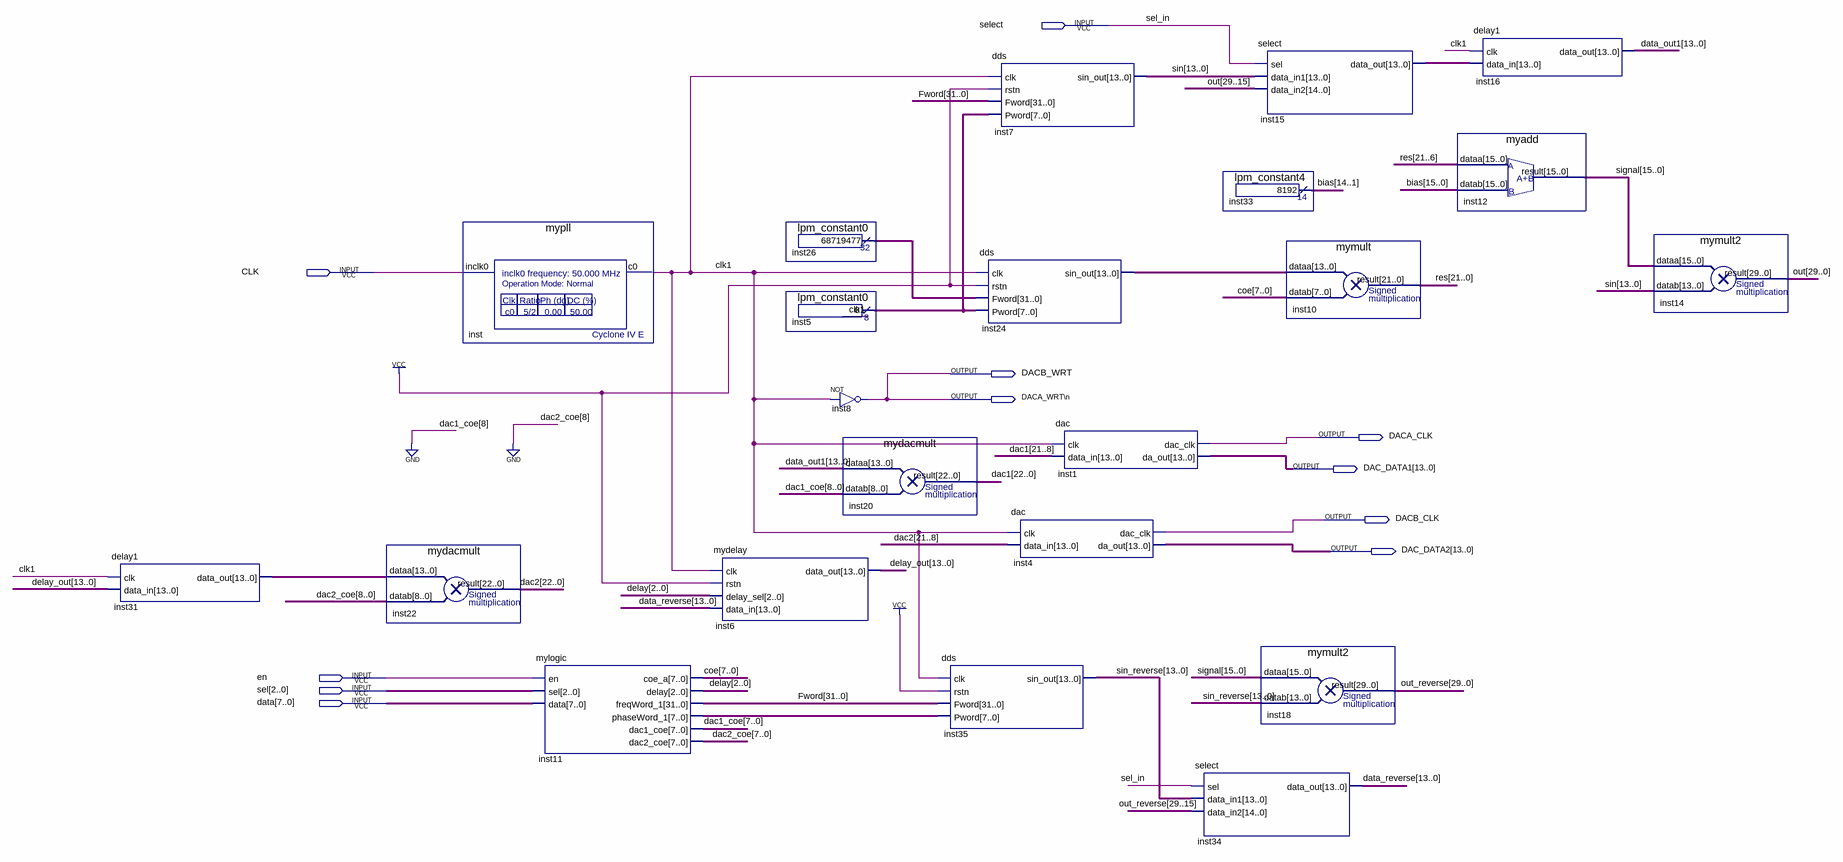
[diagram p0: schematic sheet]
// Quartus schematic am.bdf as structural Verilog: 22 symbols, 11 pins
module am (
  input  select,
  input  CLK,
  input  en,
  input  [2:0] sel,
  input  [7:0] data,
  output DACB_WRT,
  output \DACA_WRT\n ,
  output DACA_CLK,
  output [13:0] DAC_DATA1,
  output DACB_CLK,
  output [13:0] DAC_DATA2
);

  wire clk1;
  wire [2:0] delay;
  wire [7:0] coe, dac1_coe, dac2_coe, inst5_result, inst11_phaseword_1;
  wire [13:0] data_out1, data_reverse, delay_out, inst15_data_out, inst24_sin_out, inst31_data_out, sin,
       sin_reverse;
  wire [15:0] bias, signal;
  wire [21:0] res;
  wire [22:0] dac1, dac2;
  wire [29:0] out, out_reverse;
  wire [31:0] Fword, inst26_result;

  delay1 inst31 (.clk(clk1), .data_in(delay_out), .data_out(inst31_data_out));
  mydacmult inst22 (.dataa(inst31_data_out), .datab({1'b0, dac2_coe}), .result(dac2));
  mypll inst (.inclk0(CLK), .c0(clk1));
  mylogic inst11 (
    .en(en), .sel(sel), .data(data), .coe_a(coe), .delay(delay), .freqWord_1(Fword),
    .phaseWord_1(inst11_phaseword_1), .dac1_coe(dac1_coe), .dac2_coe(dac2_coe));
  mydelay inst6 (.clk(clk1), .rstn(1'b1), .delay_sel(delay), .data_in(data_reverse), .data_out(delay_out));
  lpm_constant0 inst26 (.result(inst26_result));
  lpm_constant0 inst5 (.result(inst5_result));
  not inst8 (\DACA_WRT\n , clk1);
  mydacmult inst20 (.dataa(data_out1), .datab({1'b0, dac1_coe}), .result(dac1));
  dds inst24 (.clk(clk1), .rstn(1'b1), .Fword(inst26_result), .Pword(inst5_result), .sin_out(inst24_sin_out));
  dds inst35 (.clk(clk1), .rstn(1'b1), .Fword(Fword), .Pword(inst11_phaseword_1), .sin_out(sin_reverse));
  dds inst7 (.clk(clk1), .rstn(1'b1), .Fword(Fword), .Pword(inst5_result), .sin_out(sin));
  dac inst4 (.clk(clk1), .data_in(dac2[21:8]), .dac_clk(DACB_CLK), .da_out(DAC_DATA2));
  dac inst1 (.clk(clk1), .data_in(dac1[21:8]), .dac_clk(DACA_CLK), .da_out(DAC_DATA1));
  lpm_constant4 inst33 (.result(bias[14:1]));
  select inst34 (.sel(select), .data_in1(sin_reverse), .data_in2(out_reverse[29:15]), .data_out(data_reverse));
  select inst15 (.sel(select), .data_in1(sin), .data_in2(out[29:15]), .data_out(inst15_data_out));
  mymult2 inst18 (.dataa(signal), .datab(sin_reverse), .result(out_reverse));
  mymult inst10 (.dataa(inst24_sin_out), .datab(coe), .result(res));
  delay1 inst16 (.clk(clk1), .data_in(inst15_data_out), .data_out(data_out1));
  myadd inst12 (.dataa(res[21:6]), .datab(bias), .result(signal));
  mymult2 inst14 (.dataa(signal), .datab(sin), .result(out));

  assign DACB_WRT = \DACA_WRT\n ;

  // Other names for the same wires on the sheet: sel_in = select
endmodule
